# EasyEDA Pro project ProPrj_电赛版12_2025-08-14.epro, schematic ti拓展版

## Sheets
1 主控板: Board Name: Board1; Create Date: 2025-07-11; Page Name: 主控板; Project Name: 电赛版; Schematic Name: ti拓展版; Update Date: 2025-07-27; Company: 嘉立创EDA; Drawed: 阿涛; Page Size: A2; Version: V1.0
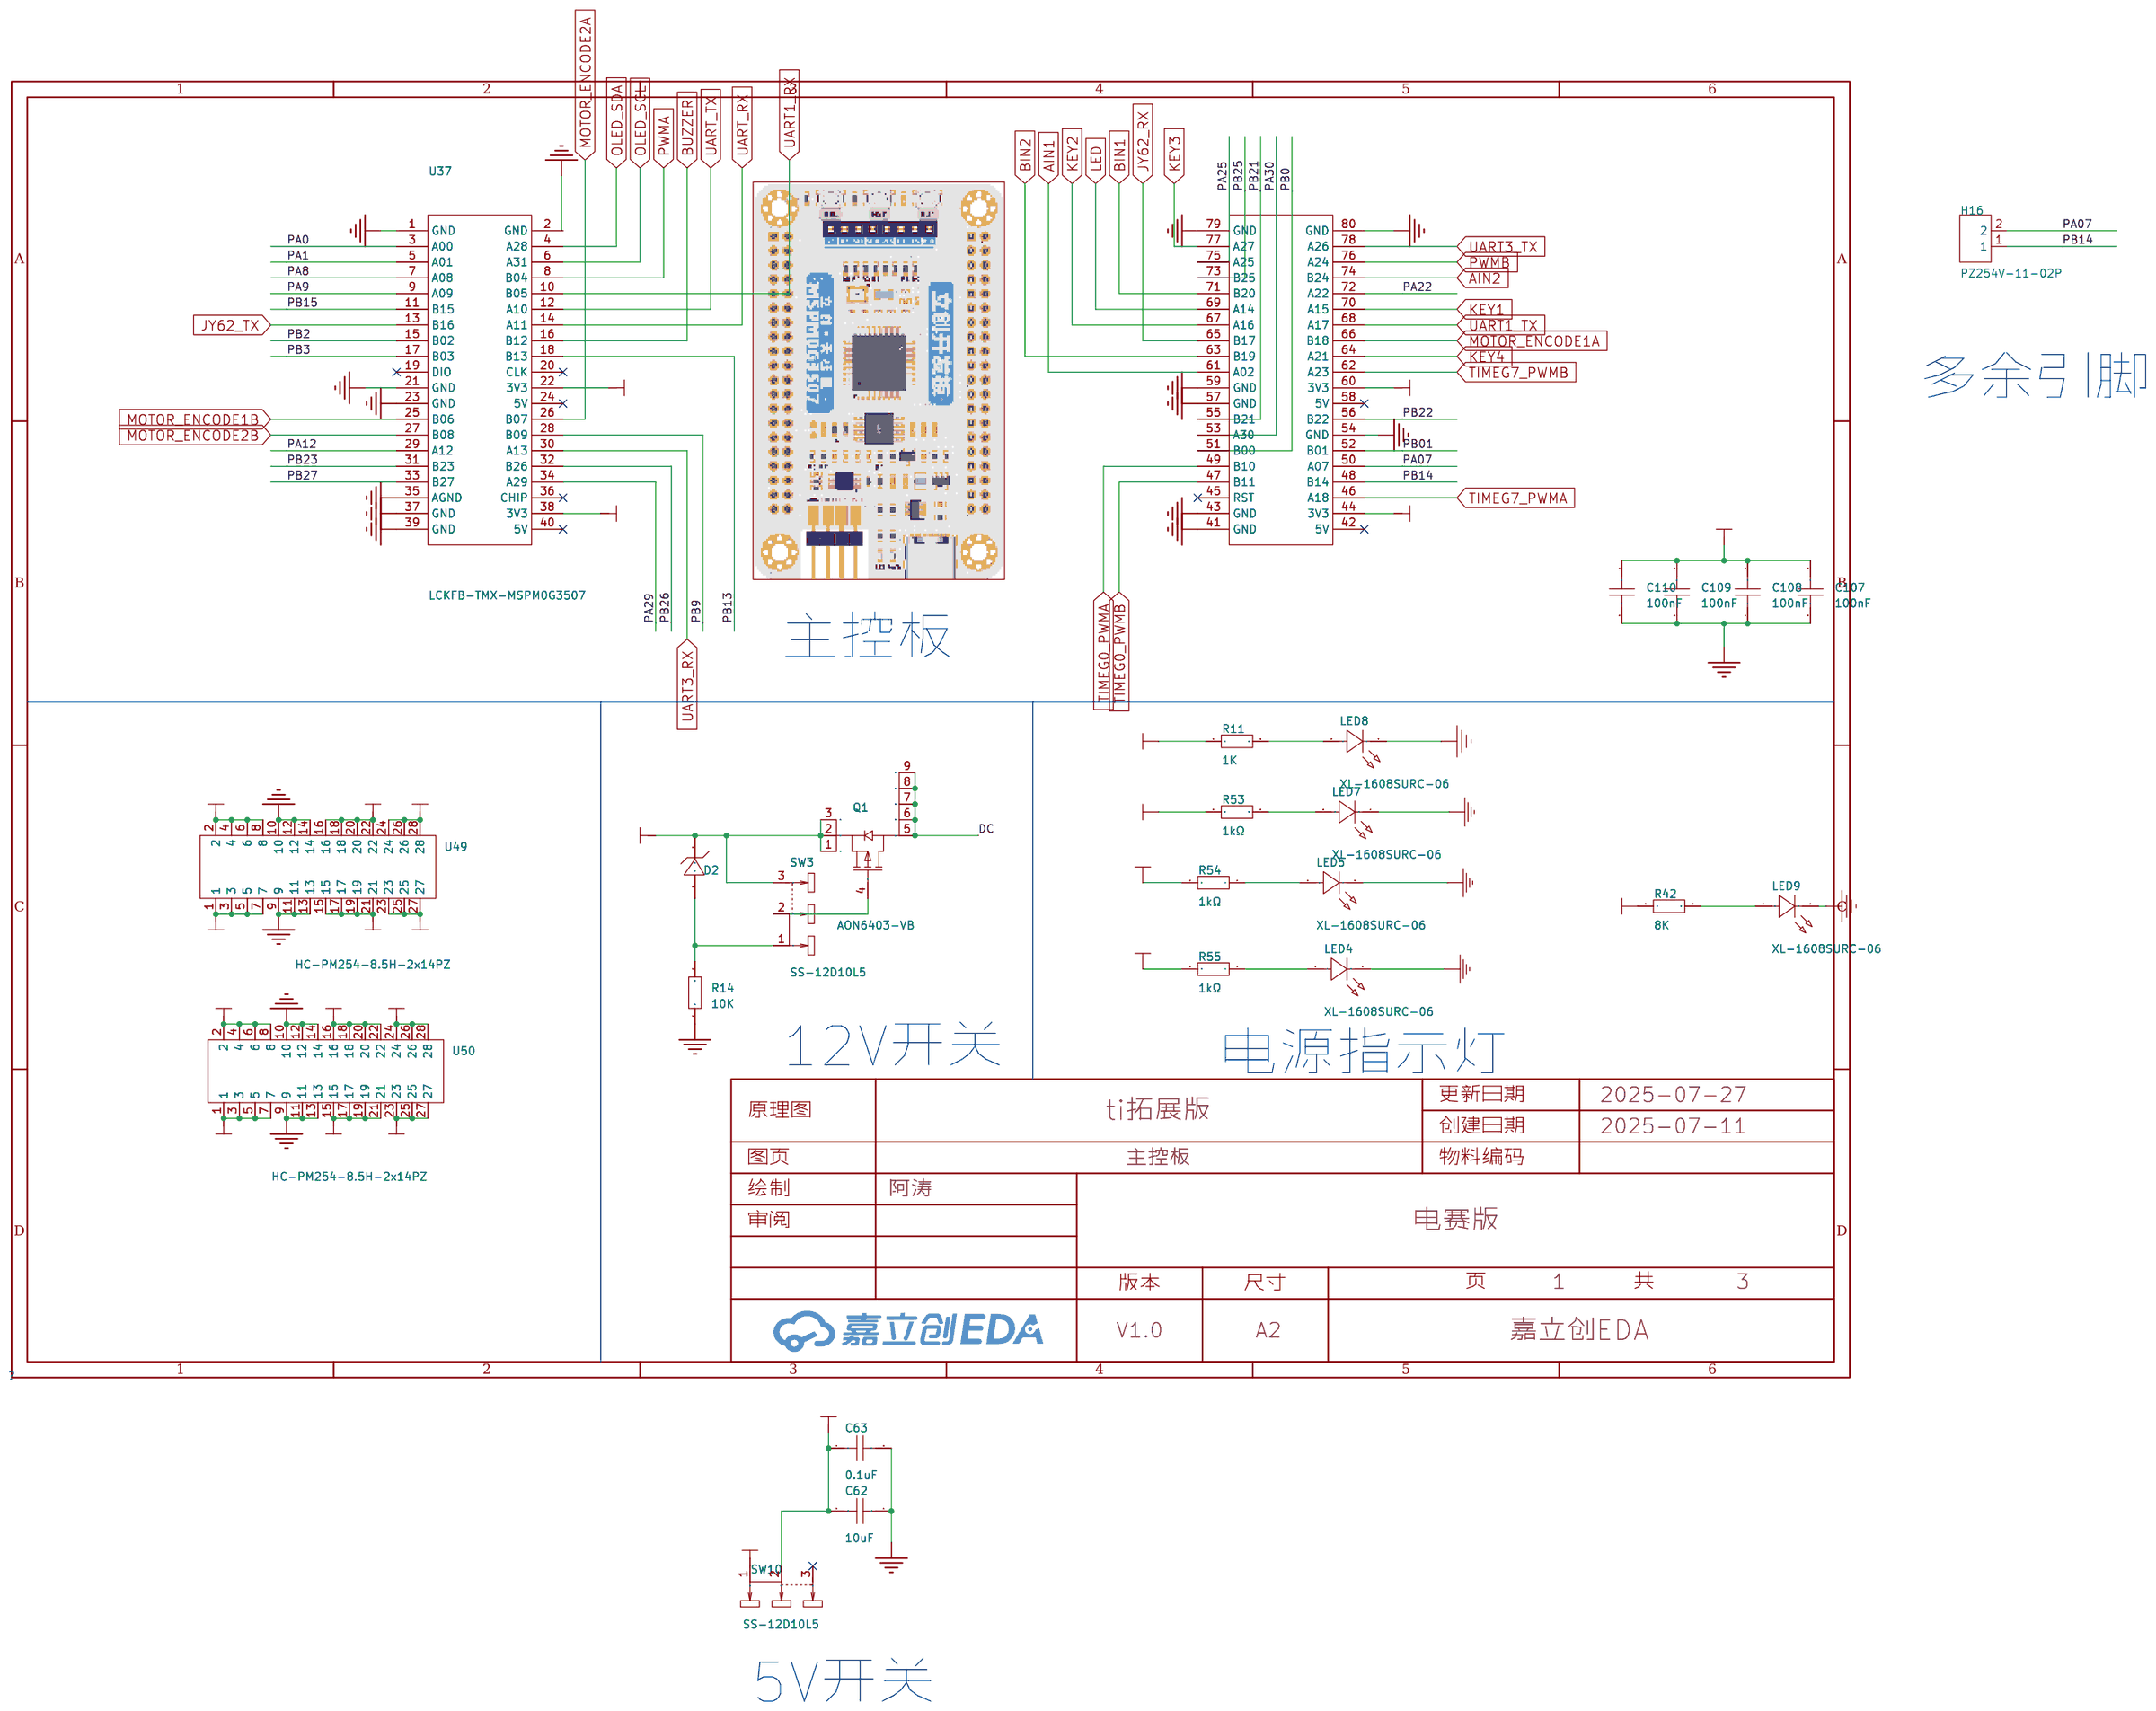
[diagram p0: 主控板]
2 基本外设: Page Name: 基本外设
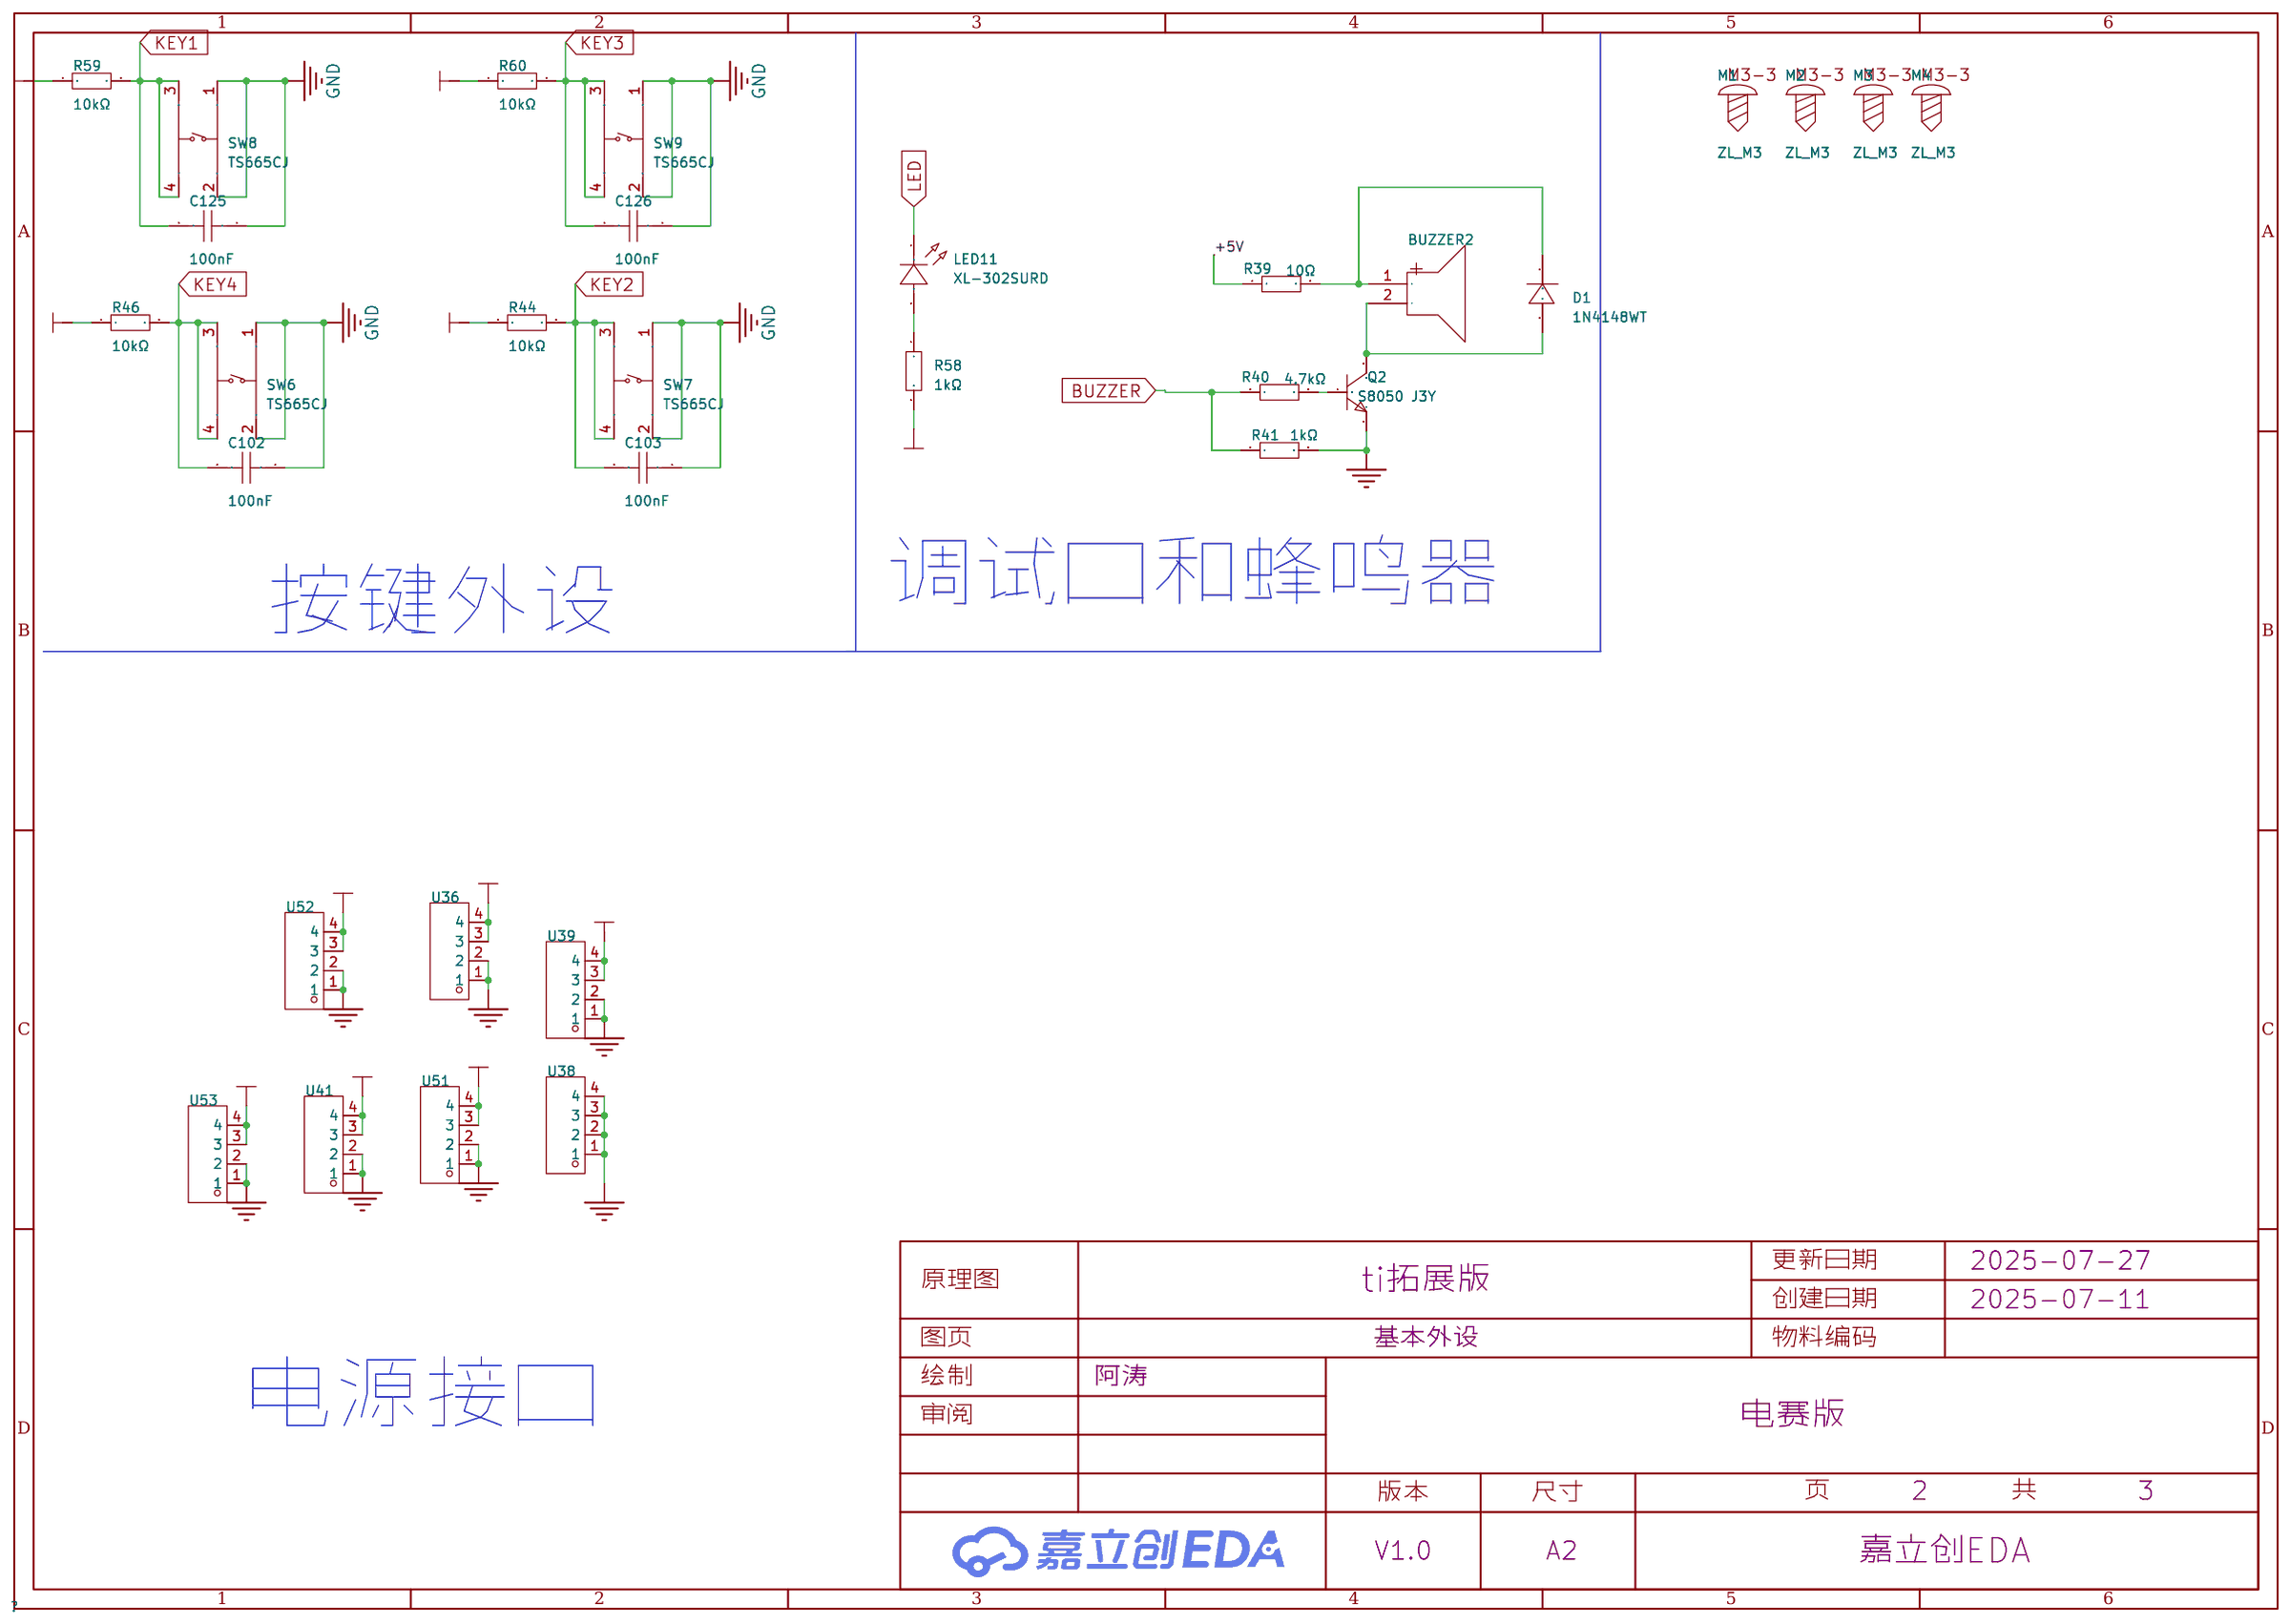
[diagram p1: 基本外设]
3 模块外设: Page Name: 模块外设
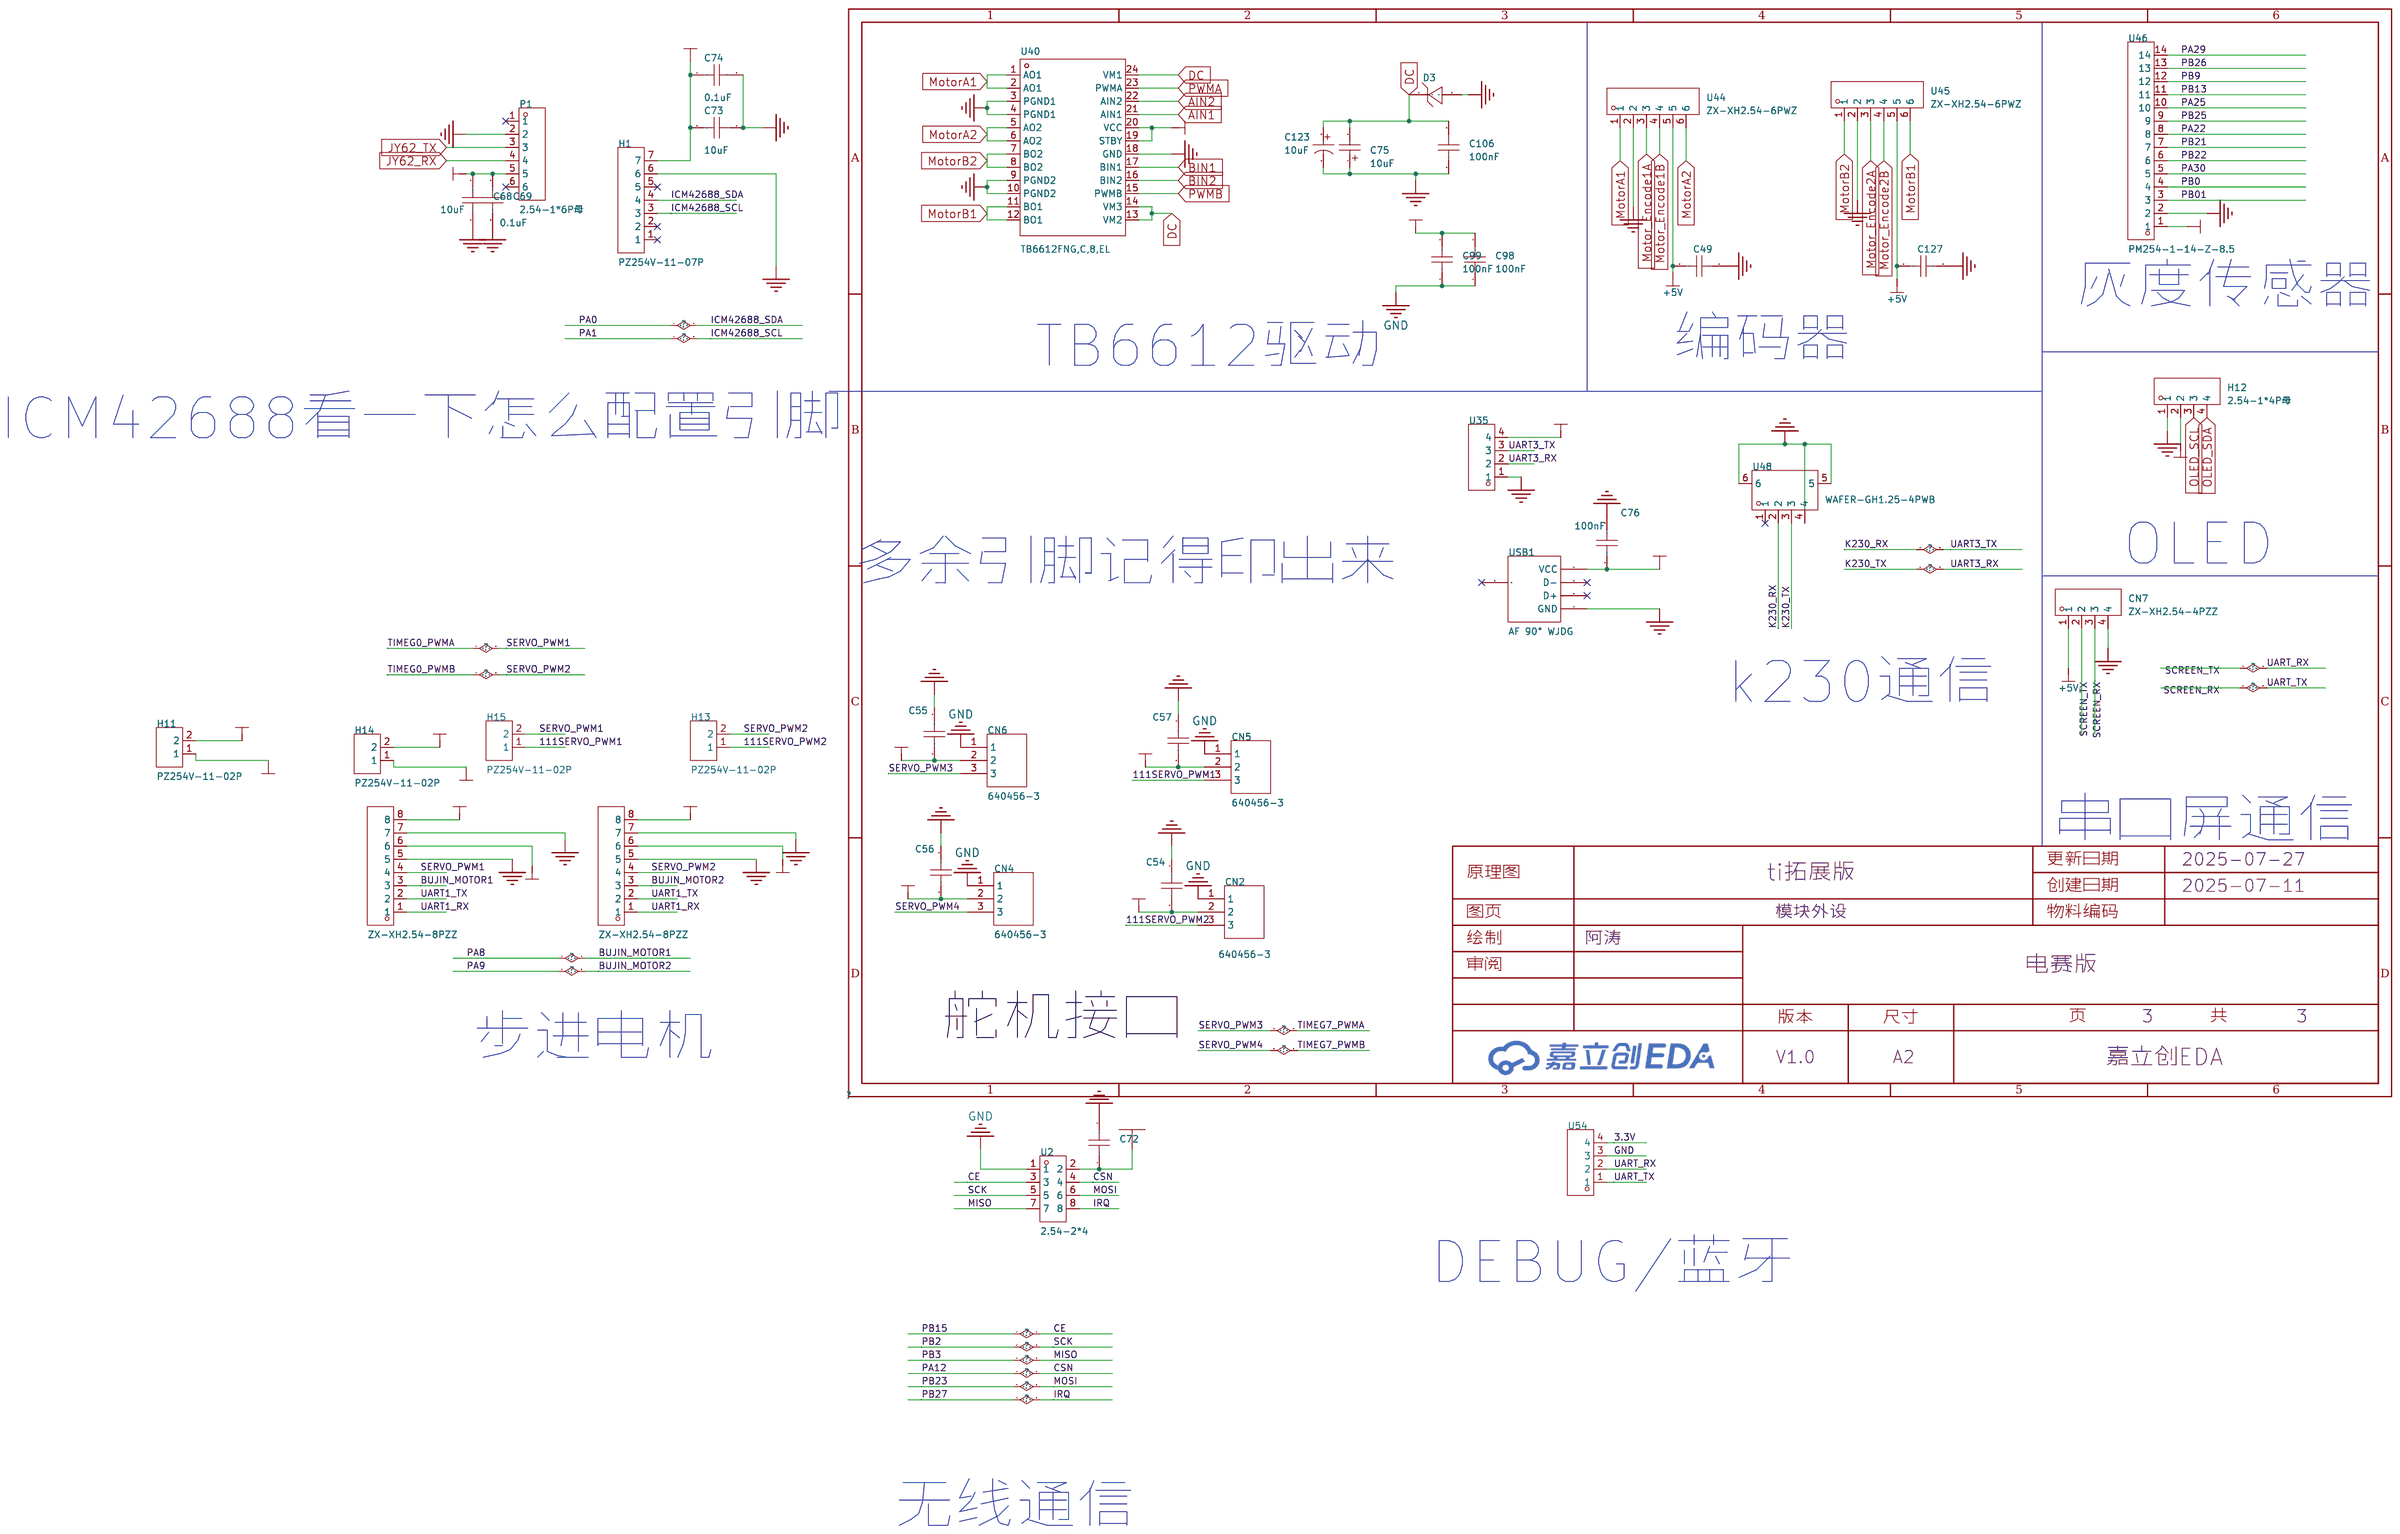
[diagram p2: 模块外设]

## Parts
sheet 主控板
C62  10uF  [C0603]
C63  0.1uF  [C0603]
C107  100nF  [C0603]
C108  100nF  [C0603]
C109  100nF  [C0603]
C110  100nF  [C0603]
D2  BZT52C16  [SOD-123_L2.7-W1.6-LS3.7-RD]
H16  PZ254V-11-02P  [HDR-TH_2P-P2.54-V-M]
LED4  XL-1608SURC-06  [LED0603-RD_RED]
LED5  XL-1608SURC-06  [LED0603-RD_RED]
LED7  XL-1608SURC-06  [LED0603-RD_RED]
LED8  XL-1608SURC-06  [LED0603-RD_RED]
LED9  XL-1608SURC-06  [LED0603-RD_RED]
Q1  AON6403-VB  [PDFN-8_L4.9-W5.8-P1.27-LS6.1-BL]
R11  1K  [R0603]
R14  10K  [R0603]
R42  8K  [R0603]
R53  1kΩ  [R0603]
R54  1kΩ  [R0603]
R55  1kΩ  [R0603]
SW3  SS-12D10L5  [SW-TH_SS-12D10L5]
SW10  SS-12D10L5  [SW-TH_SS-12D10L5]
U37  LCKFB-TMX-MSPM0G3507  [COMM-TH_LCKFB-TMX-MSPM0G3507]
U49  HC-PM254-8.5H-2x14PZ  [HDR-TH_28P-P2.54-V-F-R2-C14-S2.54]
U50  HC-PM254-8.5H-2x14PZ  [HDR-TH_28P-P2.54-V-F-R2-C14-S2.54]
sheet 基本外设
BUZZER2  2300Hz  [BUZ-TH_BD12.0-P7.60-D0.6-FD]
C102  100nF  [C0603]
C103  100nF  [C0603]
C125  100nF  [C0603]
C126  100nF  [C0603]
D1  1N4148WT  [SOD-523_L1.2-W0.8-LS1.6-RD]
LED11  XL-302SURD  [LED-TH_BD3.8-P2.54-RD]
M1  ZL_M3  [m3]
M2  ZL_M3  [m3]
M3  ZL_M3  [m3]
M4  ZL_M3  [m3]
Q2  S8050 J3Y  [SOT-23-3_L3.0-W1.7-P0.95-LS2.9-BR]
R39  10Ω  [R0603]
R40  4.7kΩ  [R0603]
R41  1kΩ  [R0603]
R44  10kΩ  [R0603]
R46  10kΩ  [R0603]
R58  1kΩ  [R0603]
R59  10kΩ  [R0603]
R60  10kΩ  [R0603]
SW6  TS665CJ  [SW-TH_4P-L6.0-W6.0-P4.50-LS6.5]
SW7  TS665CJ  [SW-TH_4P-L6.0-W6.0-P4.50-LS6.5]
SW8  TS665CJ  [SW-TH_4P-L6.0-W6.0-P4.50-LS6.5]
SW9  TS665CJ  [SW-TH_4P-L6.0-W6.0-P4.50-LS6.5]
U36  PM254-1-04-Z-8.5  [hdr-th_4p-p2.54-v-f]
U38  PM254-1-04-Z-8.5  [hdr-th_4p-p2.54-v-f]
U39  PM254-1-04-Z-8.5  [hdr-th_4p-p2.54-v-f]
U41  PM254-1-04-Z-8.5  [hdr-th_4p-p2.54-v-f]
U51  PM254-1-04-Z-8.5  [hdr-th_4p-p2.54-v-f]
U52  PM254-1-04-Z-8.5  [hdr-th_4p-p2.54-v-f]
U53  PM254-1-04-Z-8.5  [hdr-th_4p-p2.54-v-f]
sheet 模块外设
C49  100nF  [C0603]
C54  100nF  [C0603]
C55  100nF  [C0603]
C56  100nF  [C0603]
C57  100nF  [C0603]
C68  10uF  [C0603]
C69  0.1uF  [C0603]
C72  100nF  [C0603]
C73  10uF  [C0603]
C74  0.1uF  [C0603]
C75  10uF  [CASE-B_3528]
C76  100nF  [C0603]
C98  100nF  [C0603]
C99  100nF  [C0603]
C106  100nF  [C0603]
C123  10uF  [CAP-SMD_BD6.3-L6.6-W6.6-FD]
C127  100nF  [C0603]
CN2  640456-3  [CONN-TH_640456-3]
CN4  640456-3  [CONN-TH_640456-3]
CN5  640456-3  [CONN-TH_640456-3]
CN6  640456-3  [CONN-TH_640456-3]
CN7  ZX-XH2.54-4PZZ  [CONN-TH_4P-P2.50_4PIN]
CN8  ZX-XH2.54-8PZZ  [CONN-TH_8P-P2.50-XH2.54-8P]
CN10  ZX-XH2.54-8PZZ  [CONN-TH_8P-P2.50-XH2.54-8P]
D3  BZT52C16  [SOD-123_L2.7-W1.6-LS3.7-RD]
H1  PZ254V-11-07P  [HDR-TH_7P-P2.54-V-M]
H11  PZ254V-11-02P  [HDR-TH_2P-P2.54-V-M]
H12  2.54-1*4P母  [hdr-th_4p-p2.54-v-f]
H13  PZ254V-11-02P  [HDR-TH_2P-P2.54-V-M]
H14  PZ254V-11-02P  [HDR-TH_2P-P2.54-V-M]
H15  PZ254V-11-02P  [HDR-TH_2P-P2.54-V-M]
P1  2.54-1*6P母  [hdr-th_6p-p2.54-v-f]
U2  2.54-2*4  [HDR-TH_8P-P2.54-V-F-R2-C4-S2.54]
U35  PM254-1-04-Z-8.5  [hdr-th_4p-p2.54-v-f]
U40  TB6612FNG,C,8,EL  [SSOP-24_L8.3-W5.6-P0.65-LS7.6-BL]
U44  ZX-XH2.54-6PWZ  [CONN-TH_6P-P2.50_ZX-XH2.54-6PWZ]
U45  ZX-XH2.54-6PWZ  [CONN-TH_6P-P2.50_ZX-XH2.54-6PWZ]
U46  PM254-1-14-Z-8.5  [HDR-TH_14P-P2.54-V-F-1]
U48  WAFER-GH1.25-4PWB  [CONN-SMD_4P-P1.25_XUNPU_WAFER-GH1.25-4PWB]
U54  PM254-1-04-Z-8.5  [hdr-th_4p-p2.54-v-f]
USB1  AF 90° WJDG  [USB-A-TH_AF-WJDG]

## Library data of the parts
C62 C63 C68 C69 C73 C74 = CAP_0603: Supplier Footprint: 0603
C76 C98 C99 C102 C103 C106-C110 C125 C126 = CGA0603X7R104K500JT: 容值:100nF;精度:±10%;额定电压:50V;材质(温度系数):X7R;; LCSC Part Name: 100nF ±10% 50V; Supplier Part: C6119867; Manufacturer: HRE(芯声); Supplier Footprint: 0603; JLCPCB Part Class: 扩展库; Supplier: LCSC; Tolerance: ±10%; Voltage Rated: 50V; Temperature Coefficient: X7R
D2 D3 = BZT52C16_C173426: 二极管配置:独立式;稳压值(标称值):16V;稳压值(范围):15.3V~17.1V;功率:500mW;精度:-;; Supplier Part: C173426; Manufacturer: MDD; Supplier Footprint: SOD-123; JLCPCB Part Class: 扩展库; Datasheet: https://atta.szlcsc.com/upload/public/pdf/source/20230823/A46C7C97908205398E4407DE202CED03.pdf; Supplier: LCSC; Diode Configuration: 独立式; Zener Voltage (Nom): 16V; Reverse Leakage Current (Ir): 100nA@11.2V; Zener Voltage (Range): 15.3V~17.1V; Power Dissipation: 500mW; Zener Impedance (Zzt): 40Ω
H11 H13-H16 = PZ254V-11-02P: 插针结构:1x2P;间距:2.54mm;行距:-;圆针/方针:方针;安装方式:直插;排数:单排;总PIN位数:2P;额定电流:-;额定电压:-;配合针长度:6mm;塑高:2.5mm;端接针长度:3mm;触头材质:黄铜;触头镀层:-;工作温度:-40℃~+105℃;颜色:黑色;; LCSC Part Name: 1x2P 间距:2.54mm 方针 直插; Supplier Part: C492401; Manufacturer: XFCN(兴飞); Supplier Footprint: 插件,P=2.54mm; JLCPCB Part Class: 扩展库; Datasheet: https://atta.szlcsc.com/upload/public/pdf/source/20200309/C492401_A812433581A9B211A7FFA413ADDFF0E5.pdf; Supplier: LCSC; Pin Structure: 1x2P; Pitch: 2.54mm; Circluar Pins/Square Pins: 方针; Mounting Type: 直插; Number of Rows: 单排; Number of Pins: 2P; Length of Mating Pin: 6mm; Insulation Height: 2.5mm; Length of End Connection Pin: 3mm; Contact Material: 黄铜; Operating Temperature: -40℃~+105℃; Color: 黑色
LED4 LED5 LED7-LED9 = XL-1608SURC-06: 发光颜色:红色;功率:55mW;正向电流:25mA;主波长:617nm~621nm;透镜颜色:无色透明透镜;色温:-;发光角度:120°;载带方式:正贴;工作温度:-30℃~+85℃;; Supplier Part: C965799; Manufacturer: XINGLIGHT(成兴光); Supplier Footprint: 0603; JLCPCB Part Class: 扩展库; Datasheet: https://atta.szlcsc.com/upload/public/pdf/source/20221102/D860AFDD1CDB02C5A8064103A32707E2.pdf; Supplier: LCSC; Emitted Color: 红色; Power Dissipation: 55mW; Forward Current: 25mA; Dominant Wavelength: 617nm~621nm; Peak Wavelength: 623nm; Lens Color: 无色透明透镜; Viewing Angle: 120°; Mounting Sytle: 正贴; Operating Temperature: -30℃~+85℃
Q1 = AON6403-VB: 类型:1个P沟道;漏源电压(Vdss):30V;连续漏极电流(Id):31.6A;导通电阻(RDS(on)@Vgs,Id):-;功率:66.6W;阈值电压(Vgs(th)@Id):1V@250uA;; LCSC Part Name: 1个P沟道 耐压:30V; Supplier Part: C7524994; Manufacturer: VBsemi(微碧半导体); Supplier Footprint: DFN-8(5x6); JLCPCB Part Class: 扩展库; Datasheet: https://atta.szlcsc.com/upload/public/pdf/source/20240814/65AC0502578CA3D96EE522D5AE74B521.pdf; Supplier: LCSC; Type: 1个P沟道; Drain Source Voltage (Vdss): 30V; Continuous Drain Current (Id): 31.6A; Power Dissipation (Pd): 66.6W; Gate Threshold Voltage (Vgs(th)@Id): 1V@250uA; Total Gate Charge (Qg@Vgs): 78nC@15V; Input Capacitance (Ciss@Vds): 8.65nF@15V; Operating Temperature: -55℃~+150℃
R11 R14 R42 = Res_0603: Supplier Footprint: 0603
R53-R55 R58 = 0603WAF1001T5E: 电阻类型:厚膜电阻;阻值:1kΩ;精度:±1%;功率:100mW;最大工作电压:75V;温度系数:±100ppm/℃;; LCSC Part Name: 1kΩ ±1% 100mW 厚膜电阻; Supplier Part: C21190; Manufacturer: UNI-ROYAL(厚声); Supplier Footprint: 0603; JLCPCB Part Class: 基础库; Datasheet: https://atta.szlcsc.com/upload/public/pdf/source/20200306/C422600_1E6D84923E4A46A82E41ADD87F860B5C.pdf; Supplier: LCSC; Type: 厚膜电阻; Tolerance: ±1%; Power(Watts): 100mW; Overload Voltage (Max): 75V; Temperature Coefficient: ±100ppm/℃; Operating Temperature Range: -55℃~+155℃
SW3 SW10 = SS-12D10L5: 电路结构:单刀双掷;安装方式:直插;开关颜色:黑色;额定电流(DC):3A;额定电压(DC):125V;额定电流(AC):3A;额定电压(AC):125V;机械寿命:1万次;; LCSC Part Name: 柄长5mm 直插双档 滑动开关; Supplier Part: C319012; Manufacturer: XKB Connectivity(中国星坤); Supplier Footprint: 插件; JLCPCB Part Class: 扩展库; Datasheet: https://atta.szlcsc.com/upload/public/pdf/source/20211009/D6412F37AABE6F9459A6EE7FA4DAEADB.pdf; Supplier: LCSC; Circuit: 单刀双掷; Actuator Style: 矩形柱状; Pin Style: PC引脚; Switch Length: 13mm; Switch Width: 6.8mm; Switch Height: 6.4mm; Mounting Style: 直插; Actuator Color: 黑色; Current Rating (DC): 3A; Voltage Rating (DC): 125V; Current Rating (AC): 3A; Voltage Rating (AC): 125V; Mechanical Life: 1万次; Operating Temperature: -40℃~+85℃
U37 = LCKFB-TMX-MSPM0G3507: LCSC Part Name: 立创·天猛星MSPM0G3507开发板 5件套; Supplier Part: C42378531; Manufacturer: 立创开发板; Datasheet: https://atta.szlcsc.com/upload/public/pdf/source/20241209/800332349277522348D9357AB5109808.pdf; Supplier: LCSC
U49 U50 = HC-PM254-8.5H-2x14PZ: 插孔结构:2x14P;间距:2.54mm;行距:2.54mm;圆孔/方孔:方孔;安装方式:直插;排数:双排;总孔位数:28P;额定电流:3A;额定电压:-;插孔方向:顶部;塑高:8.5mm;触头材质:黄铜;触头镀层:金;工作温度:-40℃~+105℃;; LCSC Part Name: 间距2.54mm 2x14Pin 直插 PC3.0 H8.5; Supplier Part: C22373919; Manufacturer: HC(虹成电子); Supplier Footprint: 插件,P=2.54mm; JLCPCB Part Class: 扩展库; Datasheet: https://atta.szlcsc.com/upload/public/pdf/source/20250106/222BEBF77618D835840598FCAED9CA81.pdf; Supplier: LCSC; Holes Structure: 2x14P; Pitch: 2.54mm; Row Spacing: 2.54mm; Circular Hole / Square Hole: 方孔; Mounting Type: 直插; Number of Rows: 双排; Number of Positions: 28P; Current Rating: 3A; Holes Direction: 顶部; Insulation Height: 8.5mm; Contact Material: 黄铜; Contact Plating: 金; Operating Temperature: -40℃~+105℃; PIN Length: 3mm
BUZZER2 = HMB1206-03: 驱动方式:有源(内含驱动线路);构造类型:电磁式;额定电压:3V;工作电压:1.5V~4V;频率:2300Hz;声压(SPL):85dB@3V,10cm;直径(φD):12mm;高度:6.7mm;; LCSC Part Name: 电磁式有源一体蜂鸣器HMB1206-03; Supplier Part: C96101; Manufacturer: 华能; Supplier Footprint: 插件,P=7.6mm; JLCPCB Part Class: Extended Part; Datasheet: https://atta.szlcsc.com/upload/public/pdf/source/20170522/1495448325875.pdf; Supplier: LCSC; Oscillator Circuit: 有源(内含驱动线路); Technology Type: 电磁式; Rated Voltage: 3V; Operating Voltage: 1.5V~4V; Sound Pressure Level (SPL): 85dB@3V,10cm; Diameter (φD): 12mm; Height: 6.7mm
D1 = 1N4148WT_C232841: 二极管配置:独立式;正向压降(Vf):1V@10mA;直流反向耐压(Vr):75V;整流电流:300mA;反向恢复时间(trr):4ns;; LCSC Part Name: 电压:75V 电流:300mA; Supplier Part: C232841; Manufacturer: onsemi(安森美); Supplier Footprint: SOD-523F; JLCPCB Part Class: 扩展库; Datasheet: https://atta.szlcsc.com/upload/public/pdf/source/20181222/C232841_42C5BA49E5A441BB8F6B91D0F4CD0D51.pdf; Supplier: LCSC; Diode Configuration: 独立式; Forward Voltage (Vf@If): 1V@10mA; Reverse Voltage (Vr): 75V; Rectified Current: 300mA; Reverse Leakage Current: 5uA@75V; Reverse Recovery Time (trr): 4ns; Operating Temperature: -55℃~+150℃@(Tj)
LED11 = XL-302SURD: 灯头类型:3mm圆形灯头;发光颜色:红色;功率:80mW;正向电流:30mA;主波长:615nm~620nm;透镜颜色:红色透镜;色温:-;发光角度:50°;载带方式:-;工作温度:-25℃~+85℃;; Supplier Part: C2895470; Manufacturer: XINGLIGHT(成兴光); Supplier Footprint: 插件,D=3mm; JLCPCB Part Class: 扩展库; Datasheet: https://atta.szlcsc.com/upload/public/pdf/source/20240112/E1E2B82945FD635E4907401DDE6D4922.pdf; Supplier: LCSC; Lamp Holder Type: 3mm圆形灯头; Emitted Color: 红色; Power Dissipation: 80mW; Forward Current: 30mA; Dominant Wavelength: 615nm~620nm; Peak Wavelength: 625nm; Lens Color: 红色透镜; Viewing Angle: 50°; Operating Temperature: -25℃~+85℃
M1-M4 = ZL_M3
Q2 = S8050 J3Y_C2146: 晶体管类型:NPN;集电极电流(Ic):500mA;集射极击穿电压(Vceo):25V;功率(Pd):300mW;集电极-发射极饱和电压(VCE(sat)@Ic,Ib):600mV@500mA,50mA;直流电流增益(hFE@Ic,Vce):200@50mA,1V;特征频率(fT):150MHz;工作温度:+150℃@(Tj);; LCSC Part Name: NPN Vceo=25V 300mW Icbo=100nA (200-350); Supplier Part: C2146; Manufacturer: CJ（江苏长电/长晶）; Supplier Footprint: SOT-23(SOT-23-3); JLCPCB Part Class: Basic Part; Datasheet: https://atta.szlcsc.com/upload/public/pdf/source/20140809/1457707209234.pdf; Supplier: LCSC; Transistor Type: NPN; Collector Current (Ic): 500mA; Collector-Emitter Breakdown Voltage (Vceo): 25V; Power Dissipation (Pd): 300mW; Collector-Emitter Saturation Voltage (VCE(sat)@Ic,Ib): 600mV@500mA,50mA; DC Current Gain (hFE@Ic,Vce): 200@50mA,1V; Transition Frequency (fT): 150MHz; Operating Temperature: +150℃@(Tj)
R39-R41 = RC0603FR-074K7L: 阻值:4.7kΩ;精度:±1%;功率:100mW;温度系数:±100ppm/℃;最大工作电压:75V;工作温度范围:-55℃~+155℃;; LCSC Part Name: 4.7kΩ ±1% 100mW; Supplier Part: C99782; Manufacturer: YAGEO(国巨); Supplier Footprint: 0603; JLCPCB Part Class: Extended Part; Datasheet: https://atta.szlcsc.com/upload/public/pdf/source/20171030/C99782_15093665213961068236.pdf; Supplier: LCSC; Tolerance: ±1%; Power(Watts): 100mW; Temperature Coefficient: ±100ppm/℃; Overload Voltage (Max): 75V; Operating Temperature Range: -55℃~+155℃
R44 R46 R59 R60 = RT0603BRD0710KL: 电阻类型:薄膜电阻;阻值:10kΩ;精度:±0.1%;功率:100mW;最大工作电压:75V;温度系数:±25ppm/℃;; LCSC Part Name: 薄膜电阻 10kΩ ±0.1% 100mW; Supplier Part: C95204; Manufacturer: YAGEO(国巨); Supplier Footprint: 0603; JLCPCB Part Class: 扩展库; Datasheet: https://atta.szlcsc.com/upload/public/pdf/source/20170217/1487301593756.pdf; Supplier: LCSC; Type: 薄膜电阻; Tolerance: ±0.1%; Power(Watts): 100mW; Overload Voltage (Max): 75V; Temperature Coefficient: ±25ppm/℃; Operating Temperature Range: -55℃~+155℃
SW6-SW9 = TS665CJ: 电路结构:单刀单掷;按钮形状:圆形按钮;安装方式:直插;开关长度:6mm;开关宽度:6mm;开关高度:5mm;触点电流:50mA;额定电压(DC):12V;带灯:-;机械寿命:-;; LCSC Part Name: 6*6*5mm 直插 轻触开关; Supplier Part: C393938; Manufacturer: SHOU HAN(首韩); Supplier Footprint: 插件; JLCPCB Part Class: 扩展库; Datasheet: https://atta.szlcsc.com/upload/public/pdf/source/20190521/C393938_BDABEAC600B4C55E200A80AA129B70BC.pdf; Supplier: LCSC; Circuit: 单刀单掷; Actuator Style: 圆形按钮; Mounting Style: 直插; Switch Length: 6mm; Switch Width: 6mm; Switch Height: 5mm; Contact Current: 50mA; Voltage Rating (DC): 12V
U35 U36 U38 U39 U41 U51-U54 = PM254-1-04-Z-8.5_C2897367: 插孔结构:1x4P;间距:2.54mm;行距:-;圆孔/方孔:方孔;安装类型:直插;排数:单排;总孔位数:4P;额定电流:3A;额定电压:-;插孔方向:顶部;塑高:8.5mm;触头材质:铜合金;工作温度范围:-40℃~+105℃;焊接温度(最大值):260℃@5S;; LCSC Part Name: 1x4P 间距:2.54mm 直插; Supplier Part: C2897367; Manufacturer: HCTL(华灿天禄); Supplier Footprint: 插件,P=2.54mm; JLCPCB Part Class: 扩展库; Datasheet: https://atta.szlcsc.com/upload/public/pdf/source/20230609/534BE42964C679BDE98E061007C4ABD6.pdf; Supplier: LCSC; Holes Structure: 1x4P; Pitch: 2.54mm; Circular Hole / Square Hole: 方孔; Mounting Type: 直插; Number of Rows: 单排; Number of Holes: 4P; Current Rating (Max): 3A; Holes Direction: 顶部; Insulation Height: 8.5mm; Contact Material: 铜合金; Operating Temperature Range: -40℃~+105℃; Soldering Temperature(Max): 260℃@5S
C49 C54-C57 C72 C127 = CC0603KRX7R9BB104: 容值:100nF;精度:±10%;额定电压:50V;材质(温度系数):X7R;; LCSC Part Name: 100nF ±10% 50V; Supplier Part: C14663; Manufacturer: YAGEO(国巨); Supplier Footprint: 0603; JLCPCB Part Class: 基础库; Datasheet: https://atta.szlcsc.com/upload/public/pdf/source/20180910/C282072_33301C7F631E79921B82A8DAC6BCC5B3.pdf; Supplier: LCSC; Tolerance: ±10%; Voltage Rated: 50V; Temperature Coefficient: X7R
C75 = CA45-B025K106T: 容值:10uF;精度:±10%;额定电压:25V;等效串联电阻(ESR):2.5Ω@100kHz;; LCSC Part Name: 10uF ±10% 25V; Supplier Part: C119050; Manufacturer: 湘怡中元/湘江; Supplier Footprint: CASE-B-3528-19(mm); JLCPCB Part Class: 扩展库; Datasheet: https://atta.szlcsc.com/upload/public/pdf/source/20191009/C435293_78A410F3D73489DBEAC46056C4262F7A.pdf; Supplier: LCSC; Tolerance: ±10%; Voltage Rating: 25V; Equivalent Series Resistance(ESR): 2.5Ω@100kHz; Operating Temperature: -55℃~+125℃
C123 = RVT2A100M0607_C72482: 容值:10uF;精度:±20%;额定电压:100V;纹波电流:38mA@120Hz;等效串联电阻(ESR):-;; LCSC Part Name: 10uF ±20% 100V; Supplier Part: C72482; Manufacturer: ROQANG(容强); Manufacturer Part: RVT2A100M0607; Supplier Footprint: SMD,D6.3xL7.7mm; JLCPCB Part Class: 扩展库; Datasheet: https://atta.szlcsc.com/upload/public/pdf/source/20170325/1490427950282.pdf; Supplier: LCSC; Tolerance: ±20%; Voltage Rating: 100V; Ripple Current: 38mA@120Hz; Diameter: 6.3mm; Height - Seated (Max): 7.7mm; Lifetime: 2000hrs@105℃; Operating Temperature: -40℃~+105℃
CN2 CN4-CN6 = 640456-3: 插针结构:1x3P;间距:2.54mm;安装方式:-;参考系列:-;总PIN数:3P;排数:1;每排PIN数:3;行距:-;触头材质:铜合金;; LCSC Part Name: 间距:2.54mm 1x3P; Supplier Part: C86503; Manufacturer: TE Connectivity(泰科电子); Supplier Footprint: 插件,P=2.54mm; JLCPCB Part Class: 扩展库; Datasheet: https://atta.szlcsc.com/upload/public/pdf/source/20181127/C305753_3483FB8925186ACF8DDBCF4A8DBEDF25.pdf; Supplier: LCSC; Pins Structure: 1x3P; Pitch: 2.54mm; Number of Pins: 3P; Number of Rows: 1; Number of PINs Per Row: 3; Contact Material: 铜合金
CN7 = ZX-XH2.54-4PZZ: 插针结构:1x4P;间距:2.5mm;安装方式:直插;参考系列:XH;总PIN数:4P;排数:1;每排PIN数:4;行距:-;额定电流:3A;触头材质:黄铜;触头镀层:锡;工作温度:-25℃~+85℃;; LCSC Part Name: 1x4P 间距:2.5mm 直插 系列:XH; Supplier Part: C7429634; Manufacturer: Megastar(兆星); Supplier Footprint: 插件,P=2.5mm; JLCPCB Part Class: 扩展库; Datasheet: https://atta.szlcsc.com/upload/public/pdf/source/20230619/B529A2163E0159A644AB3383D208FB03.pdf; Supplier: LCSC; Pins Structure: 1x4P; Pitch: 2.5mm; Mounting Type: 直插; Reference Series: XH; Number of Pins: 4P; Number of Rows: 1; Number of PINs Per Row: 4; Current Rating: 3A; Contact Material: 黄铜; Contact Plating: 锡; Operating Temperature: -25℃~+85℃; Voltage Rating: 250V; Plastic Material: PA66; Flame Retardant Rating: UL94V-0; Color: 白色; Z-Height of the Board: 7mm; X-Length of Bottom Edge on Board (Spacing Line): 12.5mm; Y-Width of Bottom Edge on Board: 5.9mm
CN8 CN10 = ZX-XH2.54-8PZZ: 插针结构:1x8P;间距:2.54mm;安装方式:直插;参考系列:XH;总PIN数:8P;排数:1;每排PIN数:8;行距:-;额定电流:3A;触头材质:黄铜;触头镀层:锡;工作温度范围:-25℃~+85℃;; Supplier Part: C7429638; Manufacturer: Megastar(兆星); Supplier Footprint: 插件,P=2.54mm; JLCPCB Part Class: 扩展库; Datasheet: https://atta.szlcsc.com/upload/public/pdf/source/20230619/688603DEA58996C00B1F33C46797D2C3.pdf; Supplier: LCSC; Pins Structure: 1x8P; Pitch: 2.54mm; Mounting Style: 直插; Reference Series: XH; Number of Pins: 8P; Number of Rows: 1; Number of PINs Per Row: 8; Current Rating (Max): 3A; Contact Material: 黄铜; Contact Plating: 锡; Operating Temperature Range: -25℃~+85℃
H1 = PZ254V-11-07P: 插针结构:1x7P;间距:2.54mm;行距:-;圆针/方针:方针;安装方式:直插;排数:单排;总PIN位数:7P;额定电流:-;额定电压:-;配合针长度:6mm;塑高:2.5mm;端接针长度:3mm;触头材质:黄铜;触头镀层:-;工作温度:-40℃~+105℃;颜色:黑色;; LCSC Part Name: 1x7P 间距:2.54mm 方针 直插; Supplier Part: C492406; Manufacturer: XFCN(兴飞); Supplier Footprint: 插件,P=2.54mm; JLCPCB Part Class: 扩展库; Datasheet: https://atta.szlcsc.com/upload/public/pdf/source/20200309/C492406_654C533EE691117E22DD9F76C114C2D9.pdf; Supplier: LCSC; Pin Structure: 1x7P; Pitch: 2.54mm; Circluar Pins/Square Pins: 方针; Mounting Type: 直插; Number of Rows: 单排; Number of Pins: 7P; Length of Mating Pin: 6mm; Insulation Height: 2.5mm; Length of End Connection Pin: 3mm; Contact Material: 黄铜; Operating Temperature: -40℃~+105℃; Color: 黑色
H12 = 2.54-1*4P母: 插孔结构:1x4P;间距:2.54mm;行距:-;圆孔/方孔:方孔;安装类型:直插;排数:单排;总孔位数:4P;额定电流:3A;额定电压:-;插孔方向:顶部;塑高:-;触头材质:青铜;触头镀层:-;工作温度范围:-40℃~+105℃;焊接温度(最大值):-;; LCSC Part Name: 间距:2.54mm 1x4P 直插; Supplier Part: C2718488; Manufacturer: BOOMELE(博穆精密); Supplier Footprint: 插件,P=2.54mm; JLCPCB Part Class: 扩展库; Datasheet: https://atta.szlcsc.com/upload/public/pdf/source/20210301/C2718488_F4427B881E42CAA8DDB0B1C12B3A522C.pdf; Supplier: LCSC; Holes Structure: 1x4P; Pitch: 2.54mm; Circular Hole / Square Hole: 方孔; Mounting Type: 直插; Number of Rows: 单排; Number of Holes: 4P; Current Rating (Max): 3A; Holes Direction: 顶部; Contact Material: 青铜; Operating Temperature Range: -40℃~+105℃
P1 = 2.54-1*6P母: 插孔结构:1x6P;间距:2.54mm;行距:-;安装类型:直插;排数:单排;总孔位数:6P;塑高:-;触头材质:-;触头镀层:-;; LCSC Part Name: 间距:2.54mm 1x6P 直插; Supplier Part: C40877; Manufacturer: BOOMELE(博穆精密); Supplier Footprint: 插件,P=2.54mm; JLCPCB Part Class: 扩展库; Datasheet: https://atta.szlcsc.com/upload/public/pdf/source/20210301/C2718488_F4427B881E42CAA8DDB0B1C12B3A522C.pdf; Supplier: LCSC; Holes Structure: 1x6P; Pitch: 2.54mm; Mounting Type: 直插; Number of Rows: 单排; Number of Holes: 6P
U2 = 2.54-2*4: 插孔结构:2x4P;间距:2.54mm;行距:2.54mm;圆孔/方孔:方孔;安装类型:直插;排数:双排;总孔位数:8P;额定电流:2.5A;额定电压:-;插孔方向:顶部;塑高:8.5mm;工作温度范围:-40℃~+105℃;; LCSC Part Name: 间距:2.54mm 2x4P 直插; Supplier Part: C2977588; Manufacturer: ZHOURI(洲日); Supplier Footprint: 插件,P=2.54mm; JLCPCB Part Class: 扩展库; Datasheet: https://atta.szlcsc.com/upload/public/pdf/source/20220328/363EB391BC0EB759CF231FC910753CBE.pdf; Supplier: LCSC; Holes Structure: 2x4P; Pitch: 2.54mm; Row Spacing: 2.54mm; Circular Hole / Square Hole: 方孔; Mounting Type: 直插; Number of Rows: 双排; Number of Holes: 8P; Current Rating (Max): 2.5A; Holes Direction: 顶部; Insulation Height: 8.5mm; Operating Temperature Range: -40℃~+105℃
U40 = TB6612FNG,C,8,EL: LCSC Part Name: 1A 有刷直流电机驱动芯片 5.5V; Supplier Part: C141517; Manufacturer: TOSHIBA(东芝); Supplier Footprint: SSOP-24; JLCPCB Part Class: 扩展库; Datasheet: https://atta.szlcsc.com/upload/public/pdf/source/20171128/C141517_15118625624231147036.pdf; Supplier: LCSC
U44 U45 = ZX-XH2.54-6PWZ: 插针结构:1x6P;间距:2.54mm;安装方式:弯插;参考系列:XH;总PIN数:6P;排数:1;每排PIN数:6;行距:-;额定电流:3A;触头材质:黄铜;触头镀层:锡;工作温度范围:-25℃~+85℃;; Supplier Part: C7429645; Manufacturer: Megastar(兆星); Supplier Footprint: 弯插,P=2.54mm; JLCPCB Part Class: 扩展库; Datasheet: https://atta.szlcsc.com/upload/public/pdf/source/20230619/9057EB94260093B1525D11E652DE2D7A.pdf; Supplier: LCSC; Pins Structure: 1x6P; Pitch: 2.54mm; Mounting Style: 弯插; Reference Series: XH; Number of Pins: 6P; Number of Rows: 1; Number of PINs Per Row: 6; Current Rating (Max): 3A; Contact Material: 黄铜; Contact Plating: 锡; Operating Temperature Range: -25℃~+85℃
U46 = PM254-1-14-Z-8.5: 插孔结构:1x14P;间距:2.54mm;行距:-;圆孔/方孔:方孔;安装类型:直插;排数:单排;总孔位数:14P;额定电流:3A;额定电压:-;插孔方向:顶部;塑高:8.5mm;触头材质:铜合金;工作温度范围:-40℃~+105℃;焊接温度(最大值):260℃@5S;; LCSC Part Name: 1x14P 间距:2.54mm 直插; Supplier Part: C2897377; Manufacturer: HCTL(华灿天禄); Supplier Footprint: 插件,P=2.54mm; JLCPCB Part Class: 扩展库; Datasheet: https://atta.szlcsc.com/upload/public/pdf/source/20230609/534BE42964C679BDE98E061007C4ABD6.pdf; Supplier: LCSC; Holes Structure: 1x14P; Pitch: 2.54mm; Circular Hole / Square Hole: 方孔; Mounting Type: 直插; Number of Rows: 单排; Number of Holes: 14P; Current Rating (Max): 3A; Holes Direction: 顶部; Insulation Height: 8.5mm; Contact Material: 铜合金; Operating Temperature Range: -40℃~+105℃; Soldering Temperature(Max): 260℃@5S
U48 = WAFER-GH1.25-4PWB: 插针结构:1x4P;间距:1.25mm;安装方式:卧贴;参考系列:GH;总PIN数:4P;排数:1;每排PIN数:4;行距:-;额定电流:1A;触头材质:黄铜;触头镀层:-;工作温度范围:-25℃~+85℃;; LCSC Part Name: 1x4P 间距:1.25mm 卧贴 系列:GH; Supplier Part: C3029379; Manufacturer: XUNPU(讯普); Supplier Footprint: SMD,P=1.25mm,卧贴; JLCPCB Part Class: 扩展库; Datasheet: https://atta.szlcsc.com/upload/public/pdf/source/20220527/CB8773BFB0913C3B8ABD62CB38BA101A.pdf; Supplier: LCSC; Pins Structure: 1x4P; Pitch: 1.25mm; Mounting Type: 卧贴; Reference Series: GH; Number of Pins: 4P; Number of Rows: 1; Number of PINs Per Row: 4; Current Rating: 1A; Contact Material: 黄铜; Operating Temperature: -25℃~+85℃; Voltage Rating: 125V; Plastic Material: LCP; Supplementary Features: 辅助焊脚; Color: 米色; Z-Height of the Board: 4.35mm; X-Length of Bottom Edge on Board (Spacing Line): 8.25mm; Y-Width of Bottom Edge on Board: 5mm
USB1 = AF 90° WJDG: 连接器类型:Type-A;标准:USB 2.0;公母:母;安装方式:弯插;触点数量:4P;端口数量:1;额定电流 - 电源:1.5A;工作温度范围:-25℃~+85℃;; LCSC Part Name: Type-A 母 弯插; Supplier Part: C456018; Manufacturer: SHOU HAN(首韩); Supplier Footprint: 插件; JLCPCB Part Class: 扩展库; Datasheet: https://atta.szlcsc.com/upload/public/pdf/source/20241125/1CC41152EE29FFE03A5868591A920D3B.pdf; Supplier: LCSC; Connector Type: Type-A; Standard: USB 2.0; Gender: 母; Mounting Style: 弯插; Number of Contacts: 4P; Number of Ports: 1; Current Rating - Power (Max): 1.5A; Rated Voltage (Max): 30V; Connect-Disconnect Life: 5千次; Length: 14mm; Core Colour: 白色; Operating Temperature Range: -25℃~+85℃

## Nets
3.3V: C72.1 C73.2 C74.1 C98.2 C99.2 C107.1 C108.2 C109.1 C110.1 H1.7 H11.1 H12.2 H14.1 R44.1 R46.1 R55.2 R58.2 R59.1 R60.1 U2.2 U37.22(3V3) U37.38(3V3) U37.44(3V3) U37.60(3V3) U40.19(STBY) U40.20(VCC) U50.23 U50.24 U50.25 U50.26 U50.27 U50.28 U51.3 U51.4 U54.4
5V: SW10.1 U50.1 U50.2 U50.3 U50.4 U50.5 U50.6 U50.7 U50.8
24V_1: CN10.8 U41.3 U41.4 U50.15 U50.16 U50.17 U50.18 U50.19 U50.20 U50.21 U50.22
24V_2: CN8.8 R42.1 U49.15 U49.16 U49.17 U49.18 U49.19 U49.20 U49.21 U49.22 U53.3 U53.4
+3V3_V1: CN10.6 H14.2
+3V3_V2: CN8.6 H11.2
+5V: C49.2 C62.2 C63.1 C68.2 C69.1 C76.1 C127.2 CN7.1 P1.5 R39.1 R54.2 SW10.2 U35.4 U36.3 U36.4 U44.5 U45.5 U46.1 USB1.1(VCC)
+6V: C54.2 C55.2 C56.2 C57.2 CN2.2 CN4.2 CN5.2 CN6.2 R11.1 U39.3 U39.4 U49.1 U49.2 U49.3 U49.4 U49.5 U49.6 U49.7 U49.8
GND: C49.1 C54.1 C55.1 C56.1 C57.1 C62.1 C63.2 C68.1 C69.2 C72.2 C73.1 C74.2 C75.1 C76.2 C98.1 C99.1 C102.1 C103.1 C106.1 C107.2 C108.1 C109.2 C110.2 C123.2 C125.1 C126.1 C127.1 CN2.1 CN4.1 CN5.1 CN6.1 CN7.4 CN8.5 CN8.7 CN10.5 CN10.7 D3.2(A) H1.6 H12.1 LED4.1(K) LED5.1(K) LED7.1(K) LED8.1(K) LED9.1(K) P1.2 Q2.2(E) R14.1 R41.2 SW6.1(A) SW6.2(B) SW7.1(A) SW7.2(B) SW8.1(A) SW8.2(B) SW9.1(A) SW9.2(B) U2.1 U35.1 U36.1 U36.2 U37.1(GND) U37.2(GND) U37.21(GND) U37.23(GND) U37.35(AGND) U37.37(GND) U37.39(GND) U37.41(GND) U37.43(GND) U37.54(GND) U37.57(GND) U37.59(GND) U37.79(GND) U37.80(GND) U38.1 U38.2 U38.3 U38.4 U39.1 U39.2 U40.3(PGND1) U40.4(PGND1) U40.9(PGND2) U40.10(PGND2) U40.18(GND) U41.1 U41.2 U44.2 U45.2 U46.2 U48.4 U48.5 U48.6 U49.9 U49.10 U49.11 U49.12 U49.13 U49.14 U50.9 U50.10 U50.11 U50.12 U50.13 U50.14 U51.1 U51.2 U52.1 U52.2 U53.1 U53.2 U54.3 USB1.4(GND)
111SERVO_PWM1: CN5.3 H15.1
111SERVO_PWM2: CN2.3 H13.1
+POW: D2.1(K) Q1.1(S) Q1.2(S) Q1.3(S) SW3.3 U49.23 U49.24 U49.25 U49.26 U49.27 U49.28
AIN1: U37.61(A02) U40.21(AIN1)
AIN2: U37.74(B24) U40.22(AIN2)
BIN1: U37.71(B20) U40.17(BIN1)
BIN2: U37.63(B19) U40.16(BIN2)
BUJIN_MOTOR1: CN10.3 U37.7(A08)
BUJIN_MOTOR2: CN8.3 U37.9(A09)
BUZZER: R40.1 R41.1 U37.16(B12)
CE: U2.3 U37.11(B15)
CSN: U2.4 U37.29(A12)
DC: C75.2 C106.2 C123.1 D3.1(K) Q1.5(D) Q1.6(D) Q1.7(D) Q1.8(D) Q1.9(D) R53.2 U40.13(VM2) U40.14(VM3) U40.24(VM1) U52.3 U52.4
ICM42688_SCL: H1.3 U37.5(A01)
ICM42688_SDA: H1.4 U37.3(A00)
IRQ: U2.8 U37.33(B27)
JY62_RX: P1.4 U37.65(B17)
JY62_TX: P1.3 U37.13(B16)
K230_RX: U35.3 U37.78(A26) U48.2
K230_TX: U35.2 U37.30(A13) U48.3
KEY1: C125.2 R59.2 SW8.3(C) SW8.4(D) U37.70(A15)
KEY2: C103.2 R44.2 SW7.3(C) SW7.4(D) U37.67(A16)
KEY3: C126.2 R60.2 SW9.3(C) SW9.4(D) U37.77(A27)
KEY4: C102.2 R46.2 SW6.3(C) SW6.4(D) U37.64(A21)
LED: LED11.1(K) U37.69(A14)
MISO: U2.7 U37.17(B03)
MOSI: U2.6 U37.31(B23)
MOTOR_ENCODE1A: U37.66(B18)
Motor_Encode1A: U44.3
MOTOR_ENCODE1B: U37.25(B06)
Motor_Encode1B: U44.4
MOTOR_ENCODE2A: U37.26(B07)
Motor_Encode2A: U45.3
MOTOR_ENCODE2B: U37.27(B08)
Motor_Encode2B: U45.4
MotorA1: U40.1(AO1) U40.2(AO1) U44.1
MotorA2: U40.5(AO2) U40.6(AO2) U44.6
MotorB1: U40.11(BO1) U40.12(BO1) U45.6
MotorB2: U40.7(BO2) U40.8(BO2) U45.1
OLED_SCL: H12.3 U37.6(A31)
OLED_SDA: H12.4 U37.4(A28)
PA07: H16.2 U37.50(A07)
PA22: U37.72(A22) U46.8
PA25: U37.75(A25) U46.10
PA29: U37.34(A29) U46.14
PA30: U37.53(A30) U46.5
PB0: U37.51(B00) U46.4
PB01: U37.52(B01) U46.3
PB2: U2.5 U37.15(B02)
PB9: U37.28(B09) U46.12
PB13: U37.18(B13) U46.11
PB14: H16.1 U37.48(B14)
PB21: U37.55(B21) U46.7
PB22: U37.56(B22) U46.6
PB25: U37.73(B25) U46.9
PB26: U37.32(B26) U46.13
PWMA: U37.8(B04) U40.23(PWMA)
PWMB: U37.76(A24) U40.15(PWMB)
SCREEN_RX: CN7.3 U37.12(A10) U54.1
SCREEN_TX: CN7.2 U37.14(A11) U54.2
SERVO_PWM1: CN10.4 H15.2 U37.49(B10)
SERVO_PWM2: CN8.4 H13.2 U37.47(B11)
SERVO_PWM3: CN6.3 U37.46(A18)
SERVO_PWM4: CN4.3 U37.62(A23)
UART1_RX: CN8.1 CN10.1 U37.10(B05)
UART1_TX: CN8.2 CN10.2 U37.68(A17)
$1N2192: D2.2(A) R14.2 SW3.1
$1N2290: Q1.4(G) SW3.2
$1N5297: LED4.2(A) R55.1
$1N5300: LED5.2(A) R54.1
$1N5302: LED7.2(A) R53.1
$1N5303: LED8.2(A) R11.2
$1N7215: LED9.2(A) R42.2
$2N1558: LED11.2(A) R58.1
$2N4473: BUZZER2.1(+) D1.1(C) R39.2
$2N4474: BUZZER2.2(-) D1.2(A) Q2.3(C)
$2N4475: Q2.1(B) R40.2

Not connected (* = marked no-connect by the designer): H1 1* 2* 5*; P1 1* 6*; SW10 3*; U37 19(DIO)* 20(CLK)* 24(5V)* 36(CHIP)* 40(5V)* 42(5V)* 45(RST)* 58(5V)*; U48 1*; USB1 2(D-)* 3(D+)* 5(SHLD)*

## Notes on the sheets
sheet 1
- 多余引脚
- 主控板
- 12V开关
- 电源指示灯
- 5V开关
sheet 2
- 调试口和蜂鸣器
- 按键外设
- 电源接口
sheet 3
- 灰度传感器
- TB6612驱动
- 编码器
- ICM42688看一下怎么配置引脚
- OLED
- 多余引脚记得印出来
- k230通信
- 串口屏通信
- 舵机接口
- 步进电机
- DEBUG/蓝牙
- 无线通信
